# Altium schematic sheet main.SchDoc: Наименование
size 839 x 594 mm; ApprovedBy: Утвердил; CheckedBy: Проверил; Author: Разработал; CompanyName: Организация; DrawnBy: Н.Контр; Engineer: Т.Контр; SheetNumber: 1; SheetTotal: 1; PageSetup: Record=PageOptions|CenterHorizontal=True|CenterVertical=True|PrintScale=0.94|XCorrection=1.00|YCorrection=1.00|PrintKind=1|BorderSize=5000000|LeftOffset=0|BottomOffset=0|Orientation=1|PaperLength=1000|PaperWidth=1000|Scale=100|PaperSource=7|PrintQuality=-4|MediaType=1|DitherType=10|PaperKind=A4|PrintScaleMode=1; DecimalNumber: Децимальный номер; HeadOfSector: Нач. сектора; MainDevice: Перв.примен.; Name: Наименование; DocumentName: Sheet1.SCHDOC
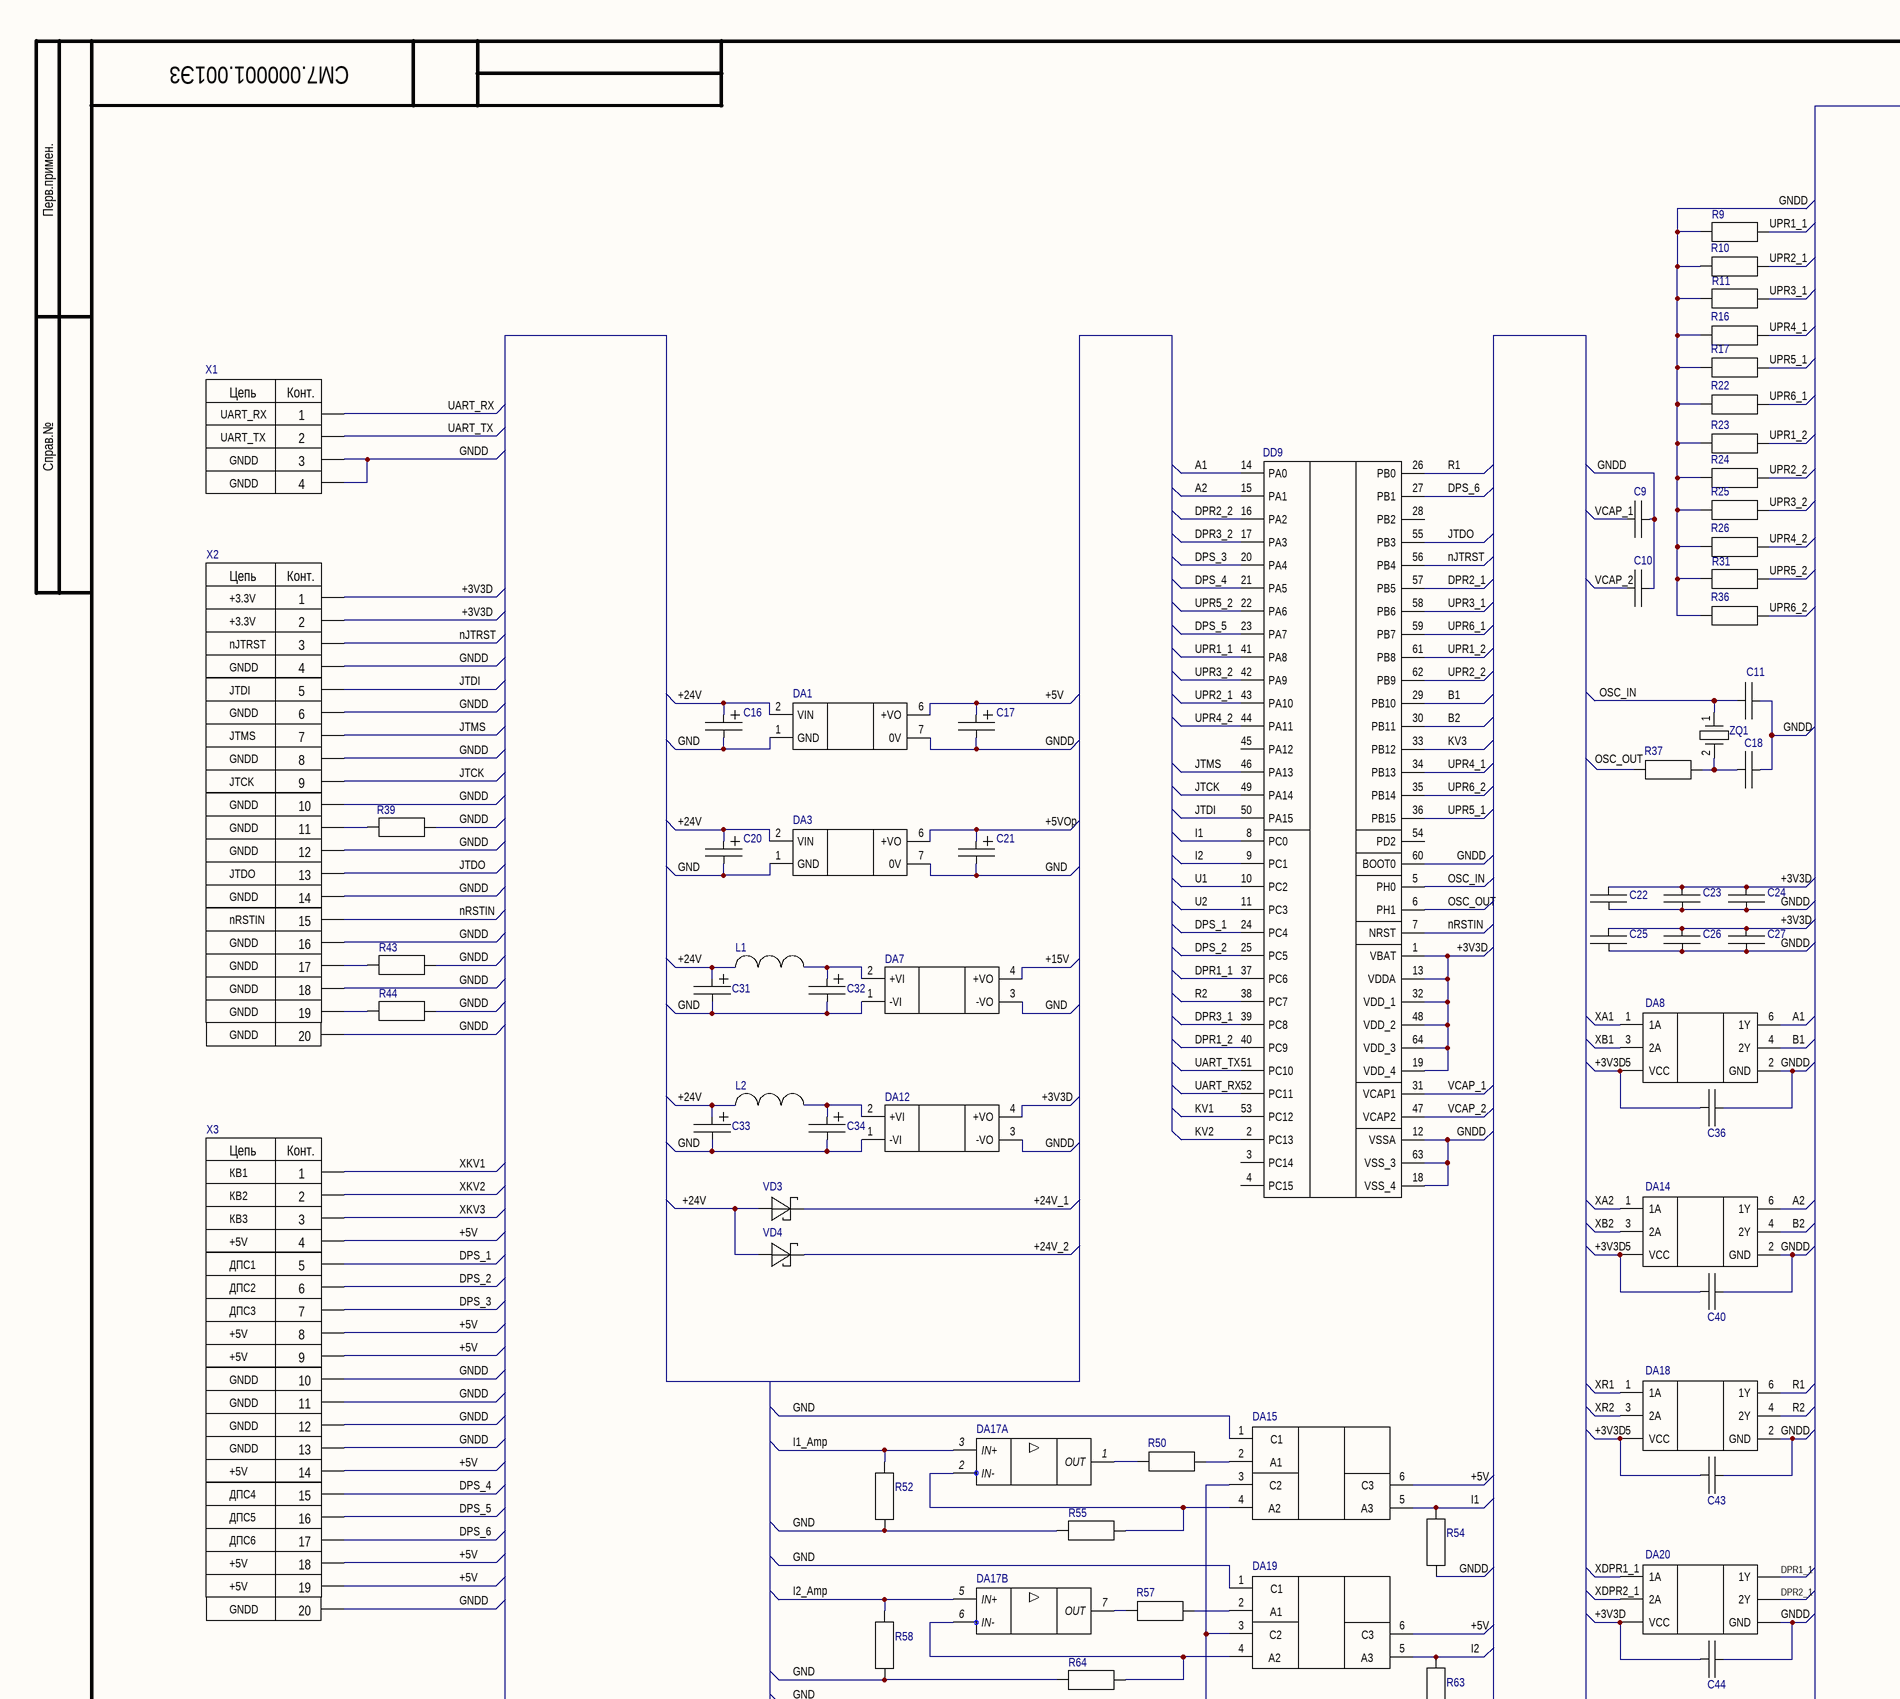
[diagram p0: main.SchDoc, top left]
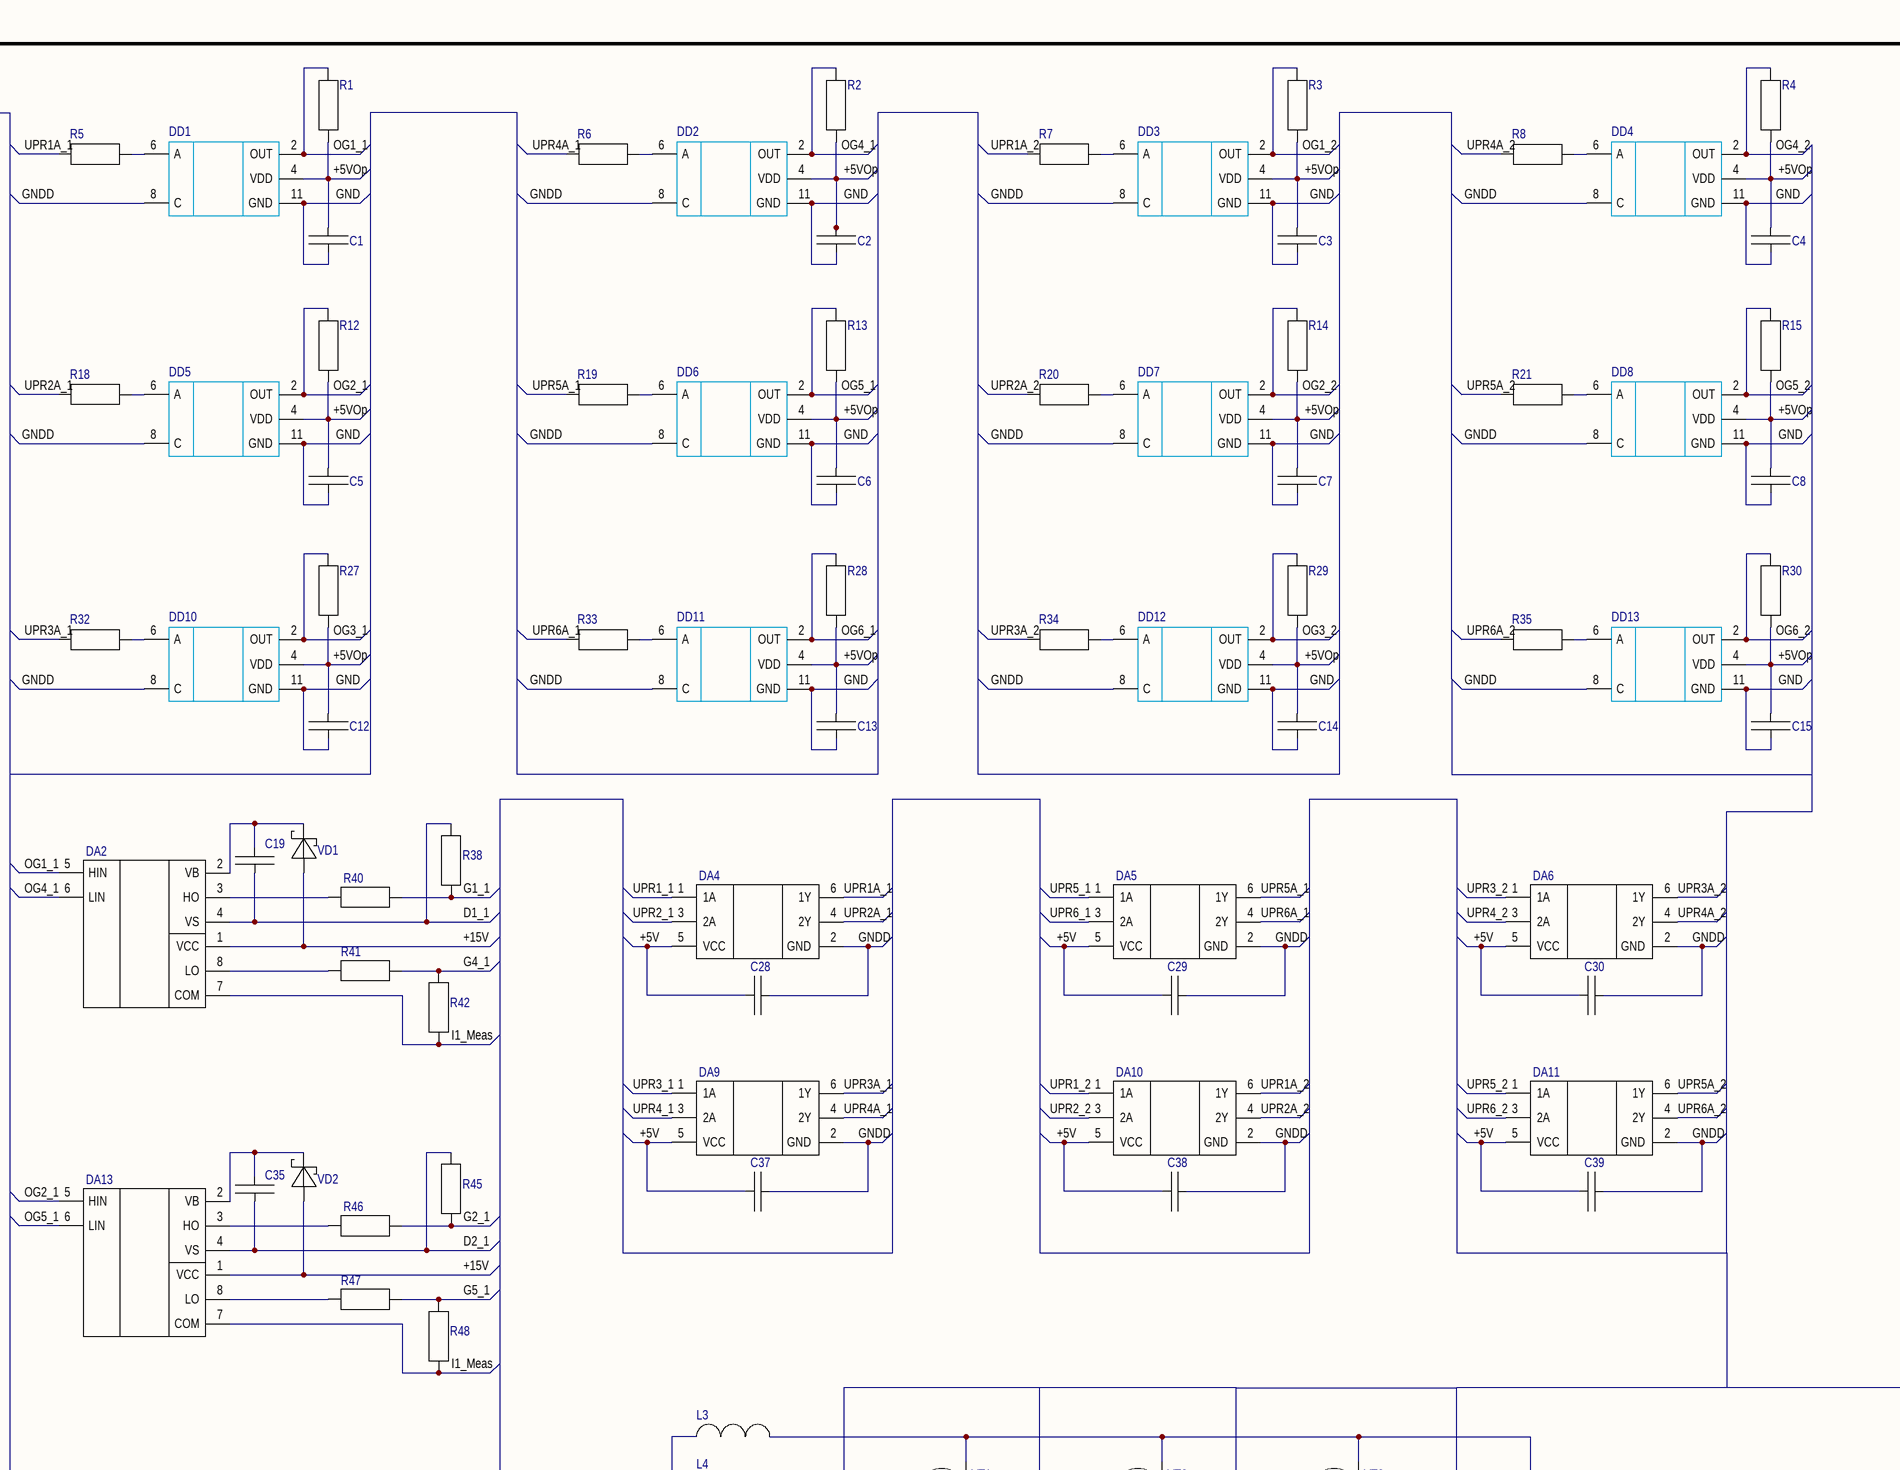
[diagram p1: main.SchDoc, top right]
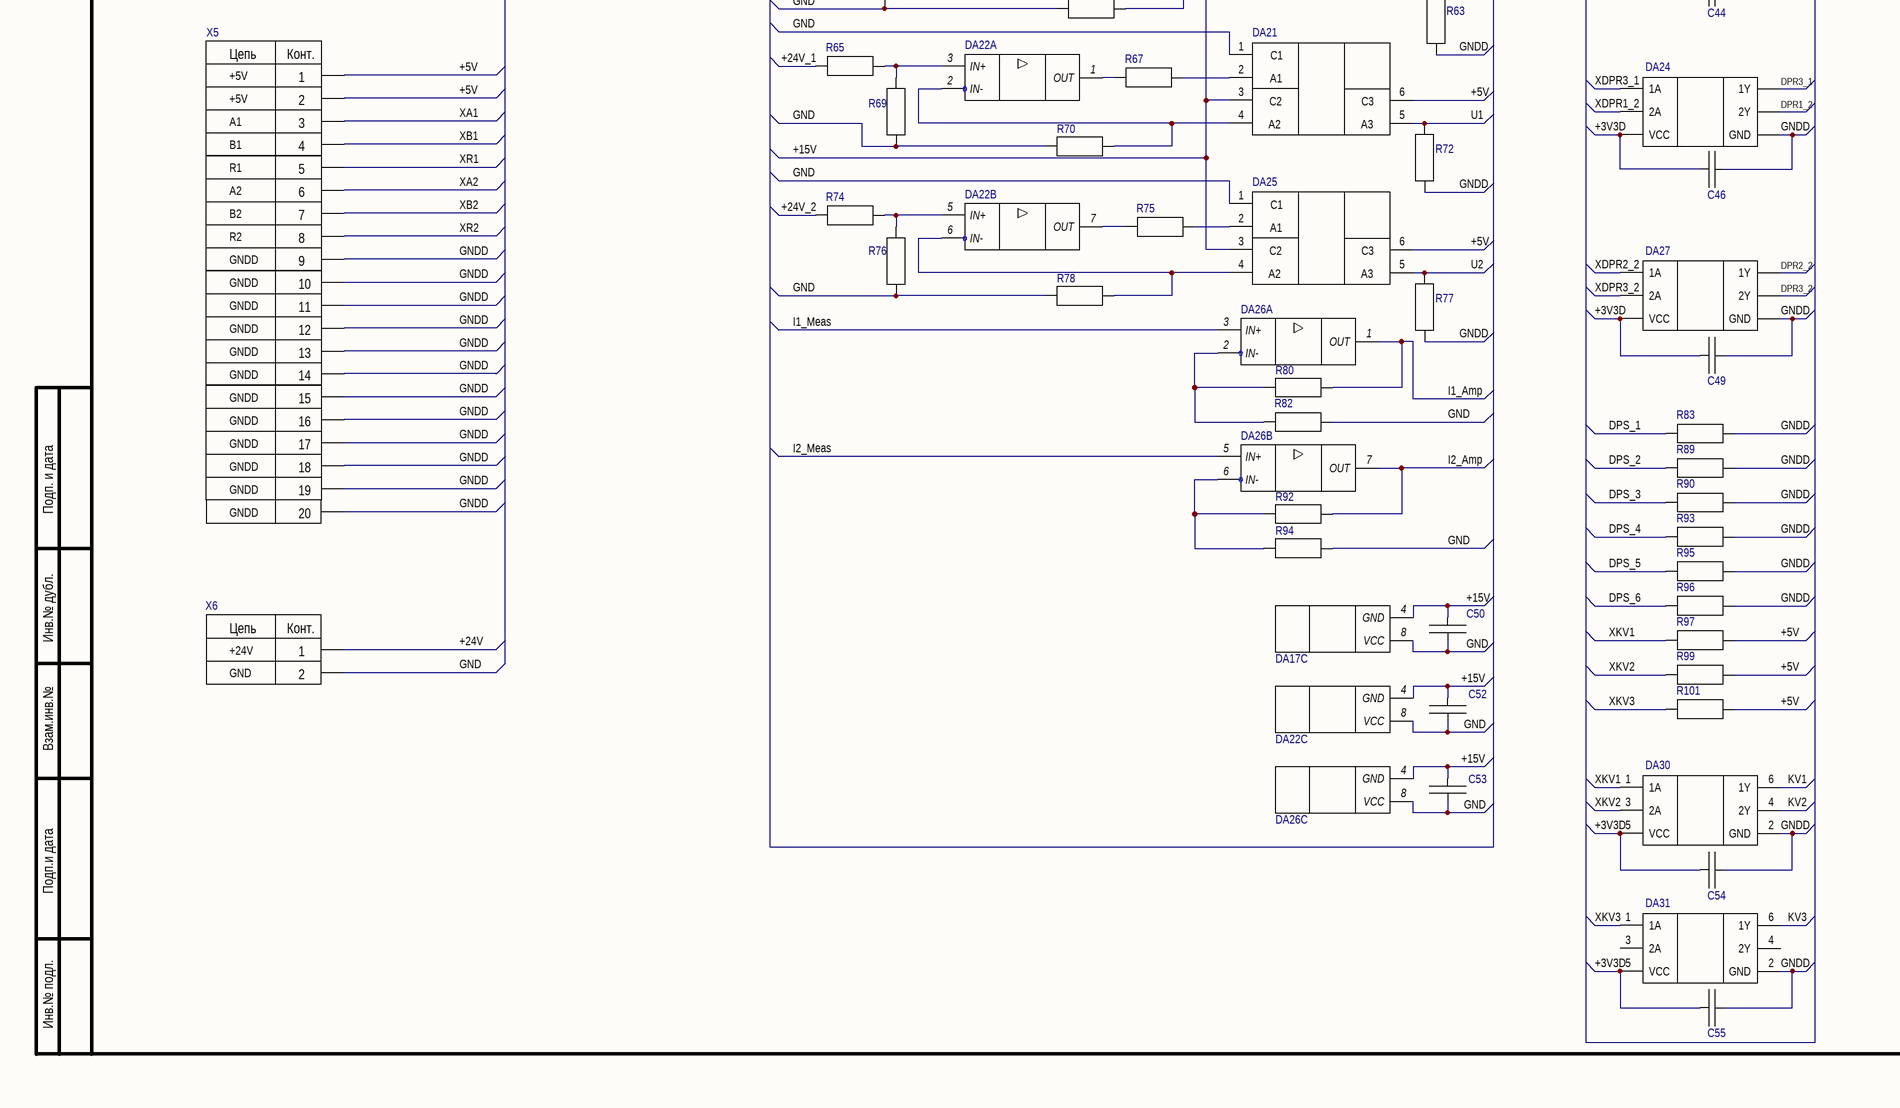
[diagram p2: main.SchDoc, bottom left]
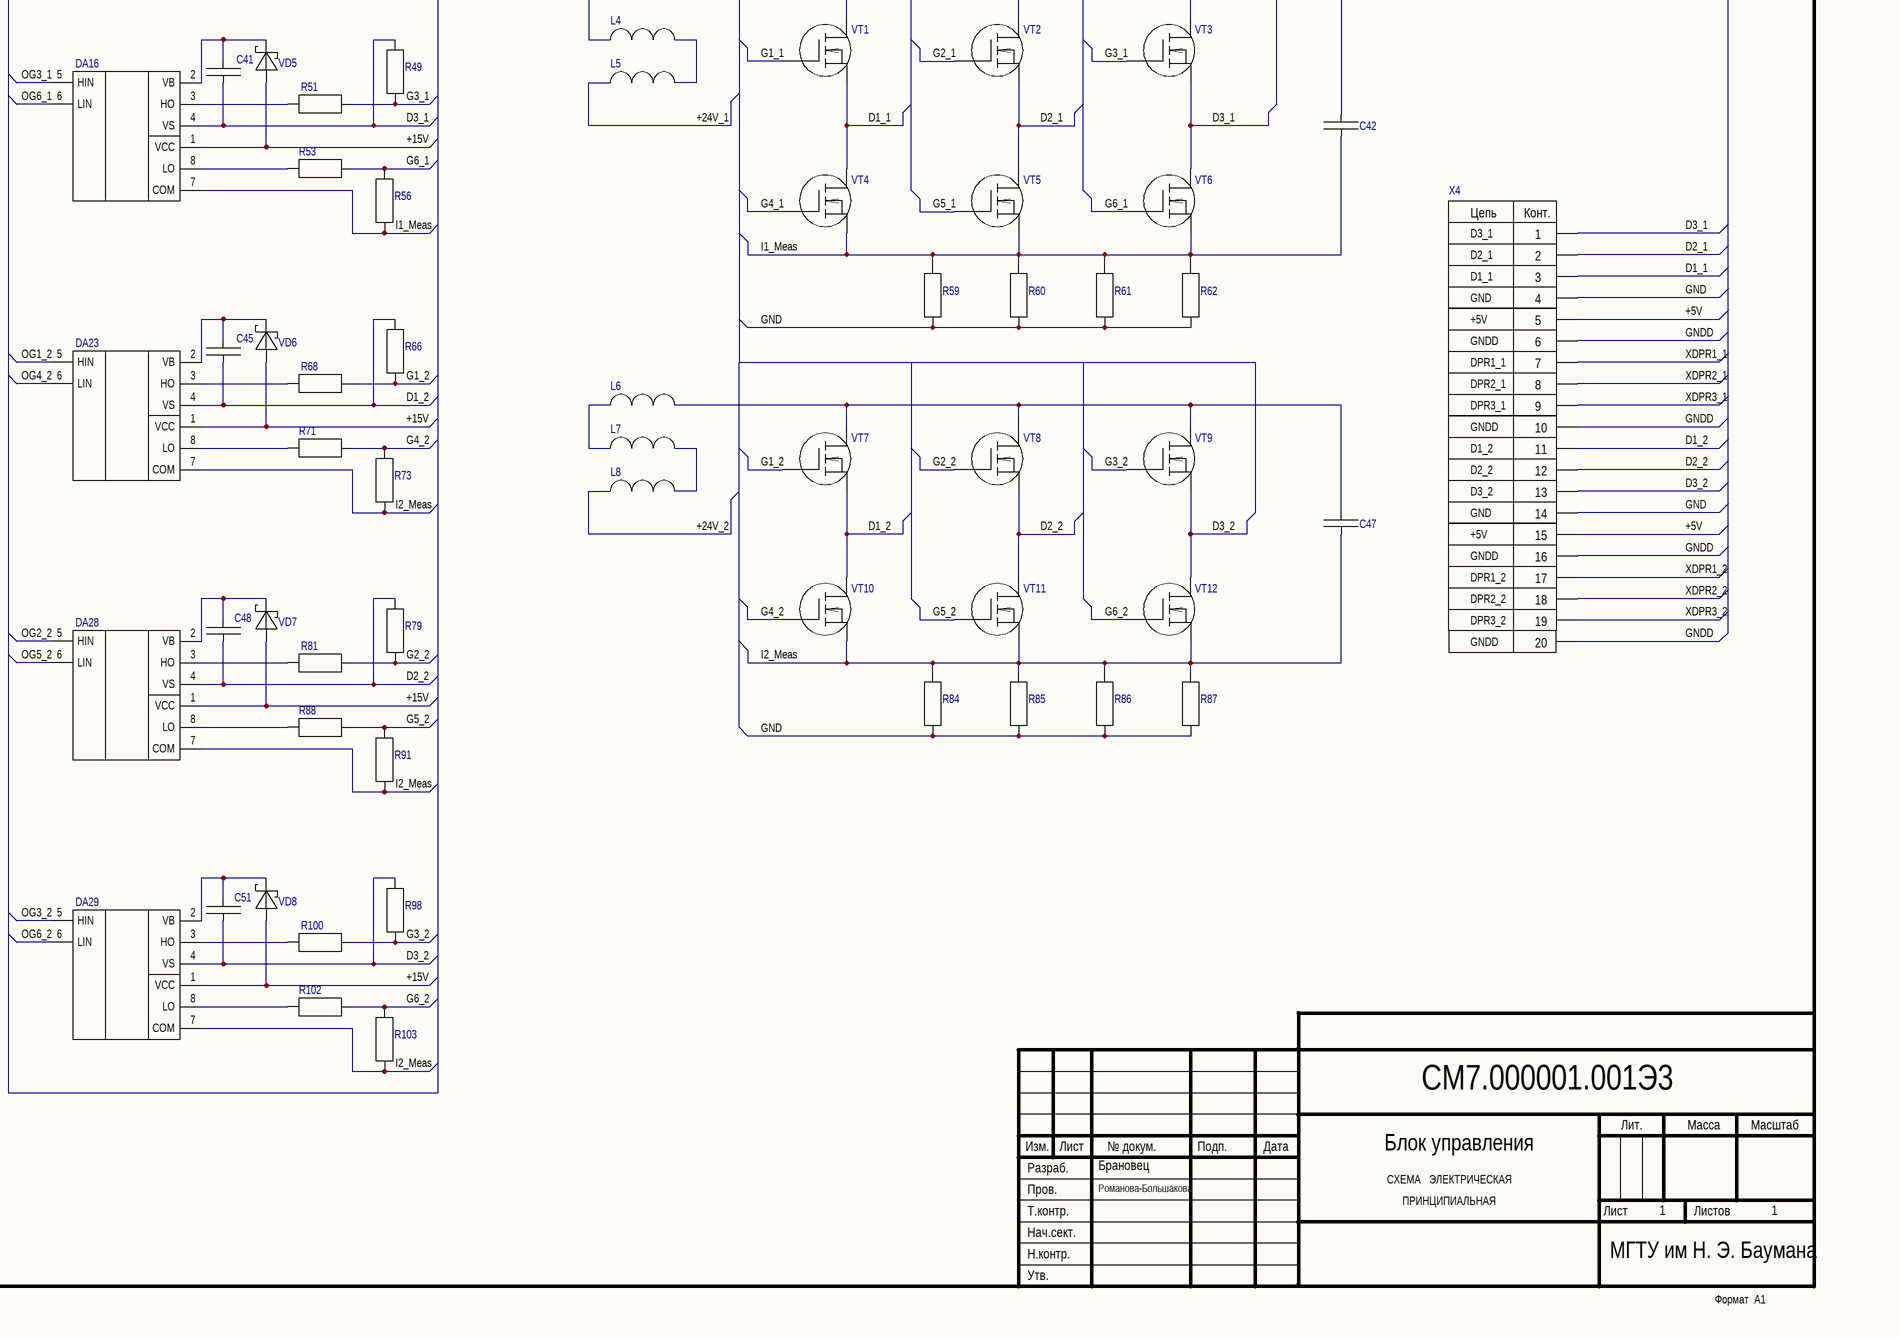
[diagram p3: main.SchDoc, bottom right]

## Parts
C1  0,1uF  [C0402C]  (value not drawn)
C2  0,1uF  [C0402C]  (value not drawn)
C3  0,1uF  [C0402C]  (value not drawn)
C4  0,1uF  [C0402C]  (value not drawn)
C5  0,1uF  [C0402C]  (value not drawn)
C6  0,1uF  [C0402C]  (value not drawn)
C7  0,1uF  [C0402C]  (value not drawn)
C8  0,1uF  [C0402C]  (value not drawn)
C9  2,2uF  [C0805C]  (value not drawn)
C10  2,2uF  [C0805C]  (value not drawn)
C11  15pF  [C0603C]  (value not drawn)
C12  0,1uF  [C0402C]  (value not drawn)
C13  0,1uF  [C0402C]  (value not drawn)
C14  0,1uF  [C0402C]  (value not drawn)
C15  0,1uF  [C0402C]  (value not drawn)
C16  100,0uF 50V  [CAPAE-F]  (value not drawn)
C17  22,0uF 25V  [CAPAE-C]  (value not drawn)
C18  15pF  [C0603C]  (value not drawn)
C19  0,1uF  [C0603C]  (value not drawn)
C20  100,0uF 50V  [CAPAE-F]  (value not drawn)
C21  22,0uF 25V  [CAPAE-C]  (value not drawn)
C22  0,1uF  [C0402C]  (value not drawn)
C23  0,1uF  [C0402C]  (value not drawn)
C24  0,1uF  [C0402C]  (value not drawn)
C25  0,1uF  [C0402C]  (value not drawn)
C26  0,1uF  [C0402C]  (value not drawn)
C27  0,1uF  [C0402C]  (value not drawn)
C28  0,1uF  [C0603C]  (value not drawn)
C29  0,1uF  [C0603C]  (value not drawn)
C30  0,1uF  [C0603C]  (value not drawn)
C31  22,0uF 80V  [CAPAE-F]  (value not drawn)
C32  22,0uF 80V  [CAPAE-F]  (value not drawn)
C33  22,0uF 80V  [CAPAE-F]  (value not drawn)
C34  22,0uF 80V  [CAPAE-F]  (value not drawn)
C35  0,1uF  [C0603C]  (value not drawn)
C36  0,1uF  [C0402C]  (value not drawn)
C37  0,1uF  [C0603C]  (value not drawn)
C38  0,1uF  [C0603C]  (value not drawn)
C39  0,1uF  [C0603C]  (value not drawn)
C40  0,1uF  [C0402C]  (value not drawn)
C41  0,1uF  [C0603C]  (value not drawn)
C42  2,2uF  [C1210C]  (value not drawn)
C43  0,1uF  [C0402C]  (value not drawn)
C44  0,1uF  [C0402C]  (value not drawn)
C45  0,1uF  [C0603C]  (value not drawn)
C46  0,1uF  [C0402C]  (value not drawn)
C47  2,2uF  [C1210C]  (value not drawn)
C48  0,1uF  [C0603C]  (value not drawn)
C49  0,1uF  [C0402C]  (value not drawn)
C50  0,1uF  [C0603C]  (value not drawn)
C51  0,1uF  [C0603C]  (value not drawn)
C52  0,1uF  [C0603C]  (value not drawn)
C53  0,1uF  [C0603C]  (value not drawn)
C54  0,1uF  [C0402C]  (value not drawn)
C55  0,1uF  [C0402C]  (value not drawn)
DA1  UWF1205S-3WR3  [UWES-3WR3]  (value not drawn)
DA2  IRS2011SPbf  [SO-8]  (value not drawn)
DA3  UWF1205S-3WR3  [UWES-3WR3]  (value not drawn)
DA4  SN74LVC2G17  [SOT23-6]  (value not drawn)
DA5  SN74LVC2G17  [SOT23-6]  (value not drawn)
DA6  SN74LVC2G17  [SOT23-6]  (value not drawn)
DA7  AM2S-2415SZ  [AM2S-Z]  (value not drawn)
DA8  SN74LVC2G17  [SOT23-6]  (value not drawn)
DA9  SN74LVC2G17  [SOT23-6]  (value not drawn)
DA10  SN74LVC2G17  [SOT23-6]  (value not drawn)
DA11  SN74LVC2G17  [SOT23-6]  (value not drawn)
DA12  AM2S-2403SZ  [AM2S-Z]  (value not drawn)
DA13  IRS2011SPbf  [SO-8]  (value not drawn)
DA14  SN74LVC2G17  [SOT23-6]  (value not drawn)
DA15  IL300  [DIP8]  (value not drawn)
DA16  IRS2011SPbf  [SO-8]  (value not drawn)
DA17  LM2904DR2G  [SO-8]  (value not drawn)  (parts A,B,C of 3)
DA18  SN74LVC2G17  [SOT23-6]  (value not drawn)
DA19  IL300  [DIP8]  (value not drawn)
DA20  SN74LVC2G17  [SOT23-6]  (value not drawn)
DA21  IL300  [DIP8]  (value not drawn)
DA22  LM2904DR2G  [SO-8]  (value not drawn)  (parts A,B,C of 3)
DA23  IRS2011SPbf  [SO-8]  (value not drawn)
DA24  SN74LVC2G17  [SOT23-6]  (value not drawn)
DA25  IL300  [DIP8]  (value not drawn)
DA26  LM2904DR2G  [SO-8]  (value not drawn)  (parts A,B,C of 3)
DA27  SN74LVC2G17  [SOT23-6]  (value not drawn)
DA28  IRS2011SPbf  [SO-8]  (value not drawn)
DA29  IRS2011SPbf  [SO-8]  (value not drawn)
DA30  SN74LVC2G17  [SOT23-6]  (value not drawn)
DA31  SN74LVC2G17  [SOT23-6]  (value not drawn)
DD1  249ЛП5  [401.14-3]  (value not drawn)
DD2  249ЛП5  [401.14-3]  (value not drawn)
DD3  249ЛП5  [401.14-3]  (value not drawn)
DD4  249ЛП5  [401.14-3]  (value not drawn)
DD5  249ЛП5  [401.14-3]  (value not drawn)
DD6  249ЛП5  [401.14-3]  (value not drawn)
DD7  249ЛП5  [401.14-3]  (value not drawn)
DD8  249ЛП5  [401.14-3]  (value not drawn)
DD9  STM32F205RGT6  [LQFP64]  (value not drawn)
DD10  249ЛП5  [401.14-3]  (value not drawn)
DD11  249ЛП5  [401.14-3]  (value not drawn)
DD12  249ЛП5  [401.14-3]  (value not drawn)
DD13  249ЛП5  [401.14-3]  (value not drawn)
L1  IHLP6767GZER150M01  [IHLP-6767GZ-01]  (value not drawn)
L2  IHLP6767GZER150M01  [IHLP-6767GZ-01]  (value not drawn)
L3  IHLP6767GZER101  [IHLP-6767GZ-11]  (value not drawn)
L4  IHLP6767GZER101  [IHLP-6767GZ-11]  (value not drawn)
L5  IHLP6767GZER101  [IHLP-6767GZ-11]  (value not drawn)
L6  IHLP6767GZER101  [IHLP-6767GZ-11]  (value not drawn)
L7  IHLP6767GZER101  [IHLP-6767GZ-11]  (value not drawn)
L8  IHLP6767GZER101  [IHLP-6767GZ-11]  (value not drawn)
R1  340R  [C0805R]  (value not drawn)
R2  340R  [C0805R]  (value not drawn)
R3  340R  [C0805R]  (value not drawn)
R4  340R  [C0805R]  (value not drawn)
R5  169R  [C0805R]  (value not drawn)
R6  169R  [C0805R]  (value not drawn)
R7  169R  [C0805R]  (value not drawn)
R8  169R  [C0805R]  (value not drawn)
R9  20k  [C0402R]  (value not drawn)
R10  20k  [C0402R]  (value not drawn)
R11  20k  [C0402R]  (value not drawn)
R12  340R  [C0805R]  (value not drawn)
R13  340R  [C0805R]  (value not drawn)
R14  340R  [C0805R]  (value not drawn)
R15  340R  [C0805R]  (value not drawn)
R16  20k  [C0402R]  (value not drawn)
R17  20k  [C0402R]  (value not drawn)
R18  169R  [C0805R]  (value not drawn)
R19  169R  [C0805R]  (value not drawn)
R20  169R  [C0805R]  (value not drawn)
R21  169R  [C0805R]  (value not drawn)
R22  20k  [C0402R]  (value not drawn)
R23  20k  [C0402R]  (value not drawn)
R24  20k  [C0402R]  (value not drawn)
R25  20k  [C0402R]  (value not drawn)
R26  20k  [C0402R]  (value not drawn)
R27  340R  [C0805R]  (value not drawn)
R28  340R  [C0805R]  (value not drawn)
R29  340R  [C0805R]  (value not drawn)
R30  340R  [C0805R]  (value not drawn)
R31  20k  [C0402R]  (value not drawn)
R32  169R  [C0805R]  (value not drawn)
R33  169R  [C0805R]  (value not drawn)
R34  169R  [C0805R]  (value not drawn)
R35  169R  [C0805R]  (value not drawn)
R36  20k  [C0402R]  (value not drawn)
R37  680R  [C0402R]  (value not drawn)
R38  10k  [C0805R]  (value not drawn)
R39  10k  [C0402R]  (value not drawn)
R40  15R  [C0805R]  (value not drawn)
R41  15R  [C0805R]  (value not drawn)
R42  10k  [C0805R]  (value not drawn)
R43  10k  [C0402R]  (value not drawn)
R44  10k  [C0402R]  (value not drawn)
R45  10k  [C0805R]  (value not drawn)
R46  15R  [C0805R]  (value not drawn)
R47  15R  [C0805R]  (value not drawn)
R48  10k  [C0805R]  (value not drawn)
R49  10k  [C0805R]  (value not drawn)
R50  1.2k  [C0402R]  (value not drawn)
R51  15R  [C0805R]  (value not drawn)
R52  20k  [C0402R]  (value not drawn)
R53  15R  [C0805R]  (value not drawn)
R54  47k  [C0402R]  (value not drawn)
R55  20k  [C0402R]  (value not drawn)
R56  10k  [C0805R]  (value not drawn)
R57  1.2k  [C0402R]  (value not drawn)
R58  20k  [C0402R]  (value not drawn)
R59  0R20  [WSR-3]  (value not drawn)
R60  0R20  [WSR-3]  (value not drawn)
R61  0R20  [WSR-3]  (value not drawn)
R62  0R20  [WSR-3]  (value not drawn)
R63  47k  [C0402R]  (value not drawn)
R64  20k  [C0402R]  (value not drawn)
R65  620k  [C0402R]  (value not drawn)
R66  10k  [C0805R]  (value not drawn)
R67  1.2k  [C0402R]  (value not drawn)
R68  15R  [C0805R]  (value not drawn)
R69  20k  [C0402R]  (value not drawn)
R70  20k  [C0402R]  (value not drawn)
R71  15R  [C0805R]  (value not drawn)
R72  47k  [C0402R]  (value not drawn)
R73  10k  [C0805R]  (value not drawn)
R74  620k  [C0402R]  (value not drawn)
R75  1.2k  [C0402R]  (value not drawn)
R76  20k  [C0402R]  (value not drawn)
R77  47k  [C0402R]  (value not drawn)
R78  20k  [C0402R]  (value not drawn)
R79  10k  [C0805R]  (value not drawn)
R80  18k  [C0402R]  (value not drawn)
R81  15R  [C0805R]  (value not drawn)
R82  10k  [C0402R]  (value not drawn)
R83  95,3R  [C0805R]  (value not drawn)
R84  0R20  [WSR-3]  (value not drawn)
R85  0R20  [WSR-3]  (value not drawn)
R86  0R20  [WSR-3]  (value not drawn)
R87  0R20  [WSR-3]  (value not drawn)
R88  15R  [C0805R]  (value not drawn)
R89  95,3R  [C0805R]  (value not drawn)
R90  95,3R  [C0805R]  (value not drawn)
R91  10k  [C0805R]  (value not drawn)
R92  18k  [C0402R]  (value not drawn)
R93  95,3R  [C0805R]  (value not drawn)
R94  10k  [C0402R]  (value not drawn)
R95  95,3R  [C0805R]  (value not drawn)
R96  95,3R  [C0805R]  (value not drawn)
R97  1k  [C0402R]  (value not drawn)
R98  10k  [C0805R]  (value not drawn)
R99  1k  [C0402R]  (value not drawn)
R100  15R  [C0805R]  (value not drawn)
R101  1k  [C0402R]  (value not drawn)
R102  15R  [C0805R]  (value not drawn)
R103  10k  [C0805R]  (value not drawn)
VD1  DFLS160-7  [SOD123]  (value not drawn)
VD2  DFLS160-7  [SOD123]  (value not drawn)
VD3  VS-8TQ100S-M3  [D2-PAK]  (value not drawn)
VD4  VS-8TQ100S-M3  [D2-PAK]  (value not drawn)
VD5  DFLS160-7  [SOD123]  (value not drawn)
VD6  DFLS160-7  [SOD123]  (value not drawn)
VD7  DFLS160-7  [SOD123]  (value not drawn)
VD8  DFLS160-7  [SOD123]  (value not drawn)
VT1  IRFR7740PbF  [D-PAK]  (value not drawn)
VT2  IRFR7740PbF  [D-PAK]  (value not drawn)
VT3  IRFR7740PbF  [D-PAK]  (value not drawn)
VT4  IRFR7740PbF  [D-PAK]  (value not drawn)
VT5  IRFR7740PbF  [D-PAK]  (value not drawn)
VT6  IRFR7740PbF  [D-PAK]  (value not drawn)
VT7  IRFR7740PbF  [D-PAK]  (value not drawn)
VT8  IRFR7740PbF  [D-PAK]  (value not drawn)
VT9  IRFR7740PbF  [D-PAK]  (value not drawn)
VT10  IRFR7740PbF  [D-PAK]  (value not drawn)
VT11  IRFR7740PbF  [D-PAK]  (value not drawn)
VT12  IRFR7740PbF  [D-PAK]  (value not drawn)
X1  22-27-2041  [22-27-2041]  (value not drawn)
X2  430452009  [MolexMicroFit 10x2]  (value not drawn)
X3  430452009  [MolexMicroFit 10x2]  (value not drawn)
X4  430452009  [MolexMicroFit 10x2]  (value not drawn)
X5  430452009  [MolexMicroFit 10x2]  (value not drawn)
X6  XT30U-F  [HEADER 2 XT30U]  (value not drawn)
ZQ1  8 МГц  [ABM3]  (value not drawn)

## Nets
+3V3D: C22.1 C23.1 C24.1 C25.1 C26.1 C27.1 C36.1 C40.1 C43.1 C44.1 C46.1 C49.1 C54.1 C55.1 DA8.5(VCC) DA12.4(+VO) DA14.5(VCC) DA18.5(VCC) DA20.5(VCC) DA24.5(VCC) DA27.5(VCC) DA30.5(VCC) DA31.5(VCC) DD9.1(VBAT) DD9.13(VDDA) DD9.19(VDD_4) DD9.32(VDD_1) DD9.48(VDD_2) DD9.64(VDD_3) X2.1 X2.2
+5V: C17.1 C28.2 C29.2 C30.2 C37.2 C38.2 C39.2 DA1.6(+VO) DA4.5(VCC) DA5.5(VCC) DA6.5(VCC) DA9.5(VCC) DA10.5(VCC) DA11.5(VCC) DA15.6 DA19.6 DA21.6 DA25.6 R97.1 R99.1 R101.1 X3.4 X3.8 X3.9 X3.14 X3.18 X3.19 X4.5 X4.15 X5.1 X5.2
+5VOp: C1.1 C2.1 C3.1 C4.1 C5.1 C6.1 C7.1 C8.1 C12.1 C13.1 C14.1 C15.1 C21.1 DA3.6(+VO) DD1.4(VDD) DD2.4(VDD) DD3.4(VDD) DD4.4(VDD) DD5.4(VDD) DD6.4(VDD) DD7.4(VDD) DD8.4(VDD) DD10.4(VDD) DD11.4(VDD) DD12.4(VDD) DD13.4(VDD) R1.2 R2.2 R3.2 R4.2 R12.2 R13.2 R14.2 R15.2 R27.2 R28.2 R29.2 R30.2
+15V: C50.2 C52.2 C53.2 DA2.1(VCC) DA7.4(+VO) DA13.1(VCC) DA15.3 DA16.1(VCC) DA17.4(GND) DA19.3 DA21.3 DA22.4(GND) DA23.1(VCC) DA25.3 DA26.4(GND) DA28.1(VCC) DA29.1(VCC) VD1.A VD2.A VD5.A VD6.A VD7.A VD8.A
+24V: C16.1 C20.1 C31.1 C33.1 DA1.2(VIN) DA3.2(VIN) L1.1 L2.1 VD3.A VD4.A X6.1
+24V_1: L5.1 R65.2 VD3.C
+24V_2: L8.1 R74.2 VD4.C
A1: DA8.6(1Y) DD9.14(PA0)
A2: DA14.6(1Y) DD9.15(PA1)
B1: DA8.4(2Y) DD9.29(PB10)
B2: DA14.4(2Y) DD9.30(PB11)
D1_1: C19.2 DA2.4(VS) R38.1 VT1.S VT4.D X4.3
D1_2: C45.2 DA23.4(VS) R66.1 VT7.S VT10.D X4.11
D2_1: C35.2 DA13.4(VS) R45.1 VT2.S VT5.D X4.2
D2_2: C48.2 DA28.4(VS) R79.1 VT8.S VT11.D X4.12
D3_1: C41.2 DA16.4(VS) R49.1 VT3.S VT6.D X4.1
D3_2: C51.2 DA29.4(VS) R98.1 VT9.S VT12.D X4.13
DPR1_1: DA20.6(1Y) DD9.37(PC6)
DPR1_2: DA24.4(2Y) DD9.40(PC9)
DPR2_1: DA20.4(2Y) DD9.57(PB5)
DPR2_2: DA27.6(1Y) DD9.16(PA2)
DPR3_1: DA24.6(1Y) DD9.39(PC8)
DPR3_2: DA27.4(2Y) DD9.17(PA3)
DPS_1: DD9.24(PC4) R83.2 X3.5
DPS_2: DD9.25(PC5) R89.2 X3.6
DPS_3: DD9.20(PA4) R90.2 X3.7
DPS_4: DD9.21(PA5) R93.2 X3.15
DPS_5: DD9.23(PA7) R95.2 X3.16
DPS_6: DD9.27(PB1) R96.2 X3.17
G1_1: R38.2 R40.1 VT1.G
G1_2: R66.2 R68.1 VT7.G
G2_1: R45.2 R46.1 VT2.G
G2_2: R79.2 R81.1 VT8.G
G3_1: R49.2 R51.1 VT3.G
G3_2: R98.2 R100.1 VT9.G
G4_1: R41.1 R42.1 VT4.G
G4_2: R71.1 R73.1 VT10.G
G5_1: R47.1 R48.1 VT5.G
G5_2: R88.1 R91.1 VT11.G
G6_1: R53.1 R56.1 VT6.G
G6_2: R102.1 R103.1 VT12.G
GND: C1.2 C2.2 C3.2 C4.2 C5.2 C6.2 C7.2 C8.2 C12.2 C13.2 C14.2 C15.2 C16.2 C20.2 C21.2 C31.2 C32.2 C33.2 C34.2 C50.1 C52.1 C53.1 DA1.1(GND) DA3.1(GND) DA3.7(0V) DA7.1(-VI) DA7.3(-VO) DA12.1(-VI) DA15.1 DA17.8(VCC) DA19.1 DA21.1 DA22.8(VCC) DA25.1 DA26.8(VCC) DD1.11(GND) DD2.11(GND) DD3.11(GND) DD4.11(GND) DD5.11(GND) DD6.11(GND) DD7.11(GND) DD8.11(GND) DD10.11(GND) DD11.11(GND) DD12.11(GND) DD13.11(GND) R52.2 R55.1 R58.2 R59.2 R60.2 R61.2 R62.2 R64.1 R69.2 R70.1 R76.2 R78.1 R82.1 R84.2 R85.2 R86.2 R87.2 R94.1 X4.4 X4.14 X6.2
GNDD: C9.2 C10.2 C11.2 C17.2 C18.2 C22.2 C23.2 C24.2 C25.2 C26.2 C27.2 C28.1 C29.1 C30.1 C36.2 C37.1 C38.1 C39.1 C40.2 C43.2 C44.2 C46.2 C49.2 C54.2 C55.2 DA1.7(0V) DA4.2(GND) DA5.2(GND) DA6.2(GND) DA8.2(GND) DA9.2(GND) DA10.2(GND) DA11.2(GND) DA12.3(-VO) DA14.2(GND) DA18.2(GND) DA20.2(GND) DA24.2(GND) DA27.2(GND) DA30.2(GND) DA31.2(GND) DD1.8(C) DD2.8(C) DD3.8(C) DD4.8(C) DD5.8(C) DD6.8(C) DD7.8(C) DD8.8(C) DD9.12(VSSA) DD9.18(VSS_4) DD9.60(BOOT0) DD9.63(VSS_3) DD10.8(C) DD11.8(C) DD12.8(C) DD13.8(C) R9.2 R10.2 R11.2 R16.2 R17.2 R22.2 R23.2 R24.2 R25.2 R26.2 R31.2 R36.2 R39.1 R43.1 R44.1 R54.2 R63.2 R72.2 R77.2 R83.1 R89.1 R90.1 R93.1 R95.1 R96.1 X1.3 X1.4 X2.4 X2.6 X2.8 X2.10 X2.12 X2.14 X2.16 X2.18 X2.20 X3.10 X3.11 X3.12 X3.13 X3.20 X4.6 X4.10 X4.16 X4.20 X5.9 X5.10 X5.11 X5.12 X5.13 X5.14 X5.15 X5.16 X5.17 X5.18 X5.19 X5.20
I1: DA15.5 DD9.8(PC0) R54.1
I1_Amp: DA17.3(IN+) DA26.1(OUT) R52.1 R80.1
I1_Meas: C42.2 DA2.7(COM) DA13.7(COM) DA16.7(COM) DA26.3(IN+) R42.2 R48.2 R56.2 R59.1 R60.1 R61.1 R62.1 VT4.S VT5.S VT6.S
I2: DA19.5 DD9.9(PC1) R63.1
I2_Amp: DA17.5(IN+) DA26.7(OUT) R58.1 R92.1
I2_Meas: C47.2 DA23.7(COM) DA26.5(IN+) DA28.7(COM) DA29.7(COM) R73.2 R84.1 R85.1 R86.1 R87.1 R91.2 R103.2 VT10.S VT11.S VT12.S
JTCK: DD9.49(PA14) X2.9
JTDI: DD9.50(PA15) X2.5
JTDO: DD9.55(PB3) X2.13
JTMS: DD9.46(PA13) X2.7
KV1: DA30.6(1Y) DD9.53(PC12)
KV2: DA30.4(2Y) DD9.2(PC13)
KV3: DA31.6(1Y) DD9.33(PB12)
nJTRST: DD9.56(PB4) X2.3
nRSTIN: DD9.7(NRST) X2.15
OG1_1: DA2.5(HIN) DD1.2(OUT) R1.1
OG1_2: DA23.5(HIN) DD3.2(OUT) R3.1
OG2_1: DA13.5(HIN) DD5.2(OUT) R12.1
OG2_2: DA28.5(HIN) DD7.2(OUT) R14.1
OG3_1: DA16.5(HIN) DD10.2(OUT) R27.1
OG3_2: DA29.5(HIN) DD12.2(OUT) R29.1
OG4_1: DA2.6(LIN) DD2.2(OUT) R2.1
OG4_2: DA23.6(LIN) DD4.2(OUT) R4.1
OG5_1: DA13.6(LIN) DD6.2(OUT) R13.1
OG5_2: DA28.6(LIN) DD8.2(OUT) R15.1
OG6_1: DA16.6(LIN) DD11.2(OUT) R28.1
OG6_2: DA29.6(LIN) DD13.2(OUT) R30.1
OSC_IN: C11.1 DD9.5(PH0) ZQ1.1(OSC1)
OSC_OUT: DD9.6(PH1) R37.2
R1: DA18.6(1Y) DD9.26(PB0)
R2: DA18.4(2Y) DD9.38(PC7)
U1: DA21.5 DD9.10(PC2) R72.1
U2: DA25.5 DD9.11(PC3) R77.1
UART_RX: DD9.52(PC11) X1.1
UART_TX: DD9.51(PC10) X1.2
UPR1_1: DA4.1(1A) DD9.41(PA8) R9.1
UPR1_2: DA10.1(1A) DD9.61(PB8) R23.1
UPR1A_1: DA4.6(1Y) R5.2
UPR1A_2: DA10.6(1Y) R7.2
UPR2_1: DA4.3(2A) DD9.43(PA10) R10.1
UPR2_2: DA10.3(2A) DD9.62(PB9) R24.1
UPR2A_1: DA4.4(2Y) R18.2
UPR2A_2: DA10.4(2Y) R20.2
UPR3_1: DA9.1(1A) DD9.58(PB6) R11.1
UPR3_2: DA6.1(1A) DD9.42(PA9) R25.1
UPR3A_1: DA9.6(1Y) R32.2
UPR3A_2: DA6.6(1Y) R34.2
UPR4_1: DA9.3(2A) DD9.34(PB13) R16.1
UPR4_2: DA6.3(2A) DD9.44(PA11) R26.1
UPR4A_1: DA9.4(2Y) R6.2
UPR4A_2: DA6.4(2Y) R8.2
UPR5_1: DA5.1(1A) DD9.36(PB15) R17.1
UPR5_2: DA11.1(1A) DD9.22(PA6) R31.1
UPR5A_1: DA5.6(1Y) R19.2
UPR5A_2: DA11.6(1Y) R21.2
UPR6_1: DA5.3(2A) DD9.59(PB7) R22.1
UPR6_2: DA11.3(2A) DD9.35(PB14) R36.1
UPR6A_1: DA5.4(2Y) R33.2
UPR6A_2: DA11.4(2Y) R35.2
VCAP_1: C9.1 DD9.31(VCAP1)
VCAP_2: C10.1 DD9.47(VCAP2)
XA1: DA8.1(1A) X5.3
XA2: DA14.1(1A) X5.6
XB1: DA8.3(2A) X5.4
XB2: DA14.3(2A) X5.7
XDPR1_1: DA20.1(1A) X4.7
XDPR1_2: DA24.3(2A) X4.17
XDPR2_1: DA20.3(2A) X4.8
XDPR2_2: DA27.1(1A) X4.18
XDPR3_1: DA24.1(1A) X4.9
XDPR3_2: DA27.3(2A) X4.19
XKV1: DA30.1(1A) R97.2 X3.1
XKV2: DA30.3(2A) R99.2 X3.2
XKV3: DA31.1(1A) R101.2 X3.3
XR1: DA18.1(1A) X5.5
XR2: DA18.3(2A) X5.8
NetC18_1: C18.1 R37.1 ZQ1.2(OSC2)
NetC19_1: C19.1 DA2.2(VB) VD1.C
NetC32_1: C32.1 DA7.2(+VI) L1.2
NetC34_1: C34.1 DA12.2(+VI) L2.2
NetC35_1: C35.1 DA13.2(VB) VD2.C
NetC41_1: C41.1 DA16.2(VB) VD5.C
NetC42_1: C42.1 L3.2 VT1.D VT2.D VT3.D
NetC45_1: C45.1 DA23.2(VB) VD6.C
NetC47_1: C47.1 L6.2 VT7.D VT8.D VT9.D
NetC48_1: C48.1 DA28.2(VB) VD7.C
NetC51_1: C51.1 DA29.2(VB) VD8.C
NetDA2_3: DA2.3(HO) R40.2
NetDA2_8: DA2.8(LO) R41.2
NetDA13_3: DA13.3(HO) R46.2
NetDA13_8: DA13.8(LO) R47.2
NetDA15_2: DA15.2 R50.1
NetDA15_4: DA15.4 DA17.2(IN-) R55.2
NetDA16_3: DA16.3(HO) R51.2
NetDA16_8: DA16.8(LO) R53.2
NetDA17_1: DA17.1(OUT) R50.2
NetDA17_6: DA17.6(IN-) DA19.4 R64.2
NetDA17_7: DA17.7(OUT) R57.2
NetDA19_2: DA19.2 R57.1
NetDA21_2: DA21.2 R67.1
NetDA21_4: DA21.4 DA22.2(IN-) R70.2
NetDA22_1: DA22.1(OUT) R67.2
NetDA22_3: DA22.3(IN+) R65.1 R69.1
NetDA22_5: DA22.5(IN+) R74.1 R76.1
NetDA22_6: DA22.6(IN-) DA25.4 R78.2
NetDA22_7: DA22.7(OUT) R75.2
NetDA23_3: DA23.3(HO) R68.2
NetDA23_8: DA23.8(LO) R71.2
NetDA25_2: DA25.2 R75.1
NetDA26_2: DA26.2(IN-) R80.2 R82.2
NetDA26_6: DA26.6(IN-) R92.2 R94.2
NetDA28_3: DA28.3(HO) R81.2
NetDA28_8: DA28.8(LO) R88.2
NetDA29_3: DA29.3(HO) R100.2
NetDA29_8: DA29.8(LO) R102.2
NetDD1_6: DD1.6(A) R5.1
NetDD2_6: DD2.6(A) R6.1
NetDD3_6: DD3.6(A) R7.1
NetDD4_6: DD4.6(A) R8.1
NetDD5_6: DD5.6(A) R18.1
NetDD6_6: DD6.6(A) R19.1
NetDD7_6: DD7.6(A) R20.1
NetDD8_6: DD8.6(A) R21.1
NetDD10_6: DD10.6(A) R32.1
NetDD11_6: DD11.6(A) R33.1
NetDD12_6: DD12.6(A) R34.1
NetDD13_6: DD13.6(A) R35.1
NetL3_1: L3.1 L4.1
NetL4_2: L4.2 L5.2
NetL6_1: L6.1 L7.1
NetL7_2: L7.2 L8.2
NetR39_2: R39.2 X2.11
NetR43_2: R43.2 X2.17
NetR44_2: R44.2 X2.19

Not connected (* = marked no-connect by the designer): DA31 3(2A) 4(2Y); DD9 3(PC14) 4(PC15) 28(PB2) 45(PA12) 54(PD2)

## Notes on the sheet
- СМ7.000001.001Э3
- Перв.примен.
- UART_RX
- Справ.№
- UART_TX
- GNDD
- +3.3V
- nJTRST
- JTDI
- JTMS
- JTCK
- JTDO
- nRSTIN
- КВ1
- КВ2
- КВ3
- +5V
- ДПС1
- ДПС2
- ДПС3
- ДПС4
- ДПС5
- ДПС6
- D3_1
- D2_1
- D1_1
- GND
- DPR1_1
- DPR2_1
- A1
- B1
- D1_2
- DPR3_1
- R1
- A2
- B2
- D2_2
- D3_2
- R2
- DPR1_2
- DPR2_2
- DPR3_2
- Подп. и дата
- Инв.№ дубл.
- +24V
- Взам.инв.№
- Подп.и дата
- Разраб.
- Изм.
- Лист
- № докум.
- Подп.
- Дата
- Блок управления
- Лит.
- Масса
- Масштаб
- Т.контр.
- Пров.
- Брановец
- Романова-Большакова
- СХЕМА   ЭЛЕКТРИЧЕСКАЯ
- ПРИНЦИПИАЛЬНАЯ
- 1
- Листов
- Инв.№ подл.
- Утв.
- Н.контр.
- Нач.сект.
- МГТУ им Н. Э. Баумана
- Формат  A1
- (in symbol 22-27-2041) Цепь; Конт.
- (in symbol 430452009) Цепь; Конт.
- (in symbol IL300) C1; A1; C2; C3; A2; A3
- (in symbol XT30U-F) Цепь; Конт.

## Library data of the parts
C1-C8 C12-C15 C22-C27 C36 C40 C43 C44 C46 C49 C54 C55 = CC0402JRX7R7BB104: CC0402JRX7R7BB104, 0402 X5R 0,1 uF 16V; Manufacturer: Yageo; Value: 0,1; Tolerance: ±10%; Tmin: -55; Tmax: 125; Component Note: 0402 0,1uF ±10% 16V X5R; Part Number: CC0402JRX7R7BB104; Package: SMD 0402; Units: uF; Dielectric: X5R; Voltage: 16V; ComponentLink1Description: Datasheet; gost BOM: 0402 0,1uF ±10% 16V X5R
C9 C10 = CL21B225KAFNNNE: CL21B225KAFNNNE, 0805 X7R 2,2 uF 25V; Manufacturer: Samsung; Value: 2,2; Tolerance: ±10%; Tmin: -55; Tmax: 125; Component Note: 0805 2,2uF ±10% 25V X7R; Part Number: CL21B225KAFNNNE; Package: SMD 0805; Units: uF; Dielectric: X7R; Voltage: 25V; ComponentLink1Description: Datasheet; ComponentLink1URL: https://media.digikey.com/pdf/Data%20Sheets/Samsung%20PDFs/CL_Series_MLCC_ds.pdf; gost BOM: 0805 2,2uF ±10% 25V X7R
C11 C18 = CC0603JRNPO8BN150: CC0603JRNPO8BN150, 0603 NP0 15 pF 25V; Manufacturer: Yageo; Value: 15; Tolerance: ±5%; Tmin: -55; Tmax: 125; Component Note: 0603 15pF ±5% 25V NP0; Part Number: CC0603JRNPO8BN150; Package: SMD 0603; Units: pF; Dielectric: NP0; Voltage: 25V; ComponentLink1Description: Datasheet; gost BOM: 0603 15pF ±5% 25V NP0
C16 C20 = EEEFK1H101P: EEEFK1H101P, 50V 100,0uF ±20%; Manufacturer: Panasonic; Value: 100,0; Units: uF; ESR: 0,34; Tmin: -55; Tmax: 105; Work: 2000; Component Note: CAPAE-F 100,0uF ±20% 50V; Part Number: EEEFK1H101P; Package: CAPAE-F; Tolerance: ±20%; Voltage: 50V; ComponentLink1Description: Datasheet; ComponentLink1URL: https://sds.compel.ru/item-pdf/31583381d324fa929794119b147f5f44/ps/pan~fk_smd.pdf; gost BOM: CAPAE-F 100,0uF ±20% 50V
C17 C21 = EEEFK1E220R: EEEFK1E220R, 25V 22,0uF ±20%; Manufacturer: Panasonic; Value: 22,0; Units: uF; ESR: 0,7; Tmin: -55; Tmax: 105; Work: 2000; Component Note: CAPAE-C 22,0uF ±20% 25V; Part Number: EEEFK1E220R; Package: CAPAE-C; Tolerance: ±20%; Voltage: 25V; ComponentLink1Description: Datasheet; ComponentLink1URL: https://sds.compel.ru/item-pdf/31583381d324fa929794119b147f5f44/ps/pan~fk_smd.pdf; gost BOM: CAPAE-C 22,0uF ±20% 25V
C19 C28-C30 C35 C37-C39 C41 C45 C48 C50-C53 = CL10B104KB8NNNC: CL10B104KB8NNNC, 0603 X7R 0,1 uF 50V; Manufacturer: Samsung; Value: 0,1; Tolerance: ±10%; Tmin: -55; Tmax: 125; Component Note: 0603 0,1uF ±10% 50V X7R; Part Number: CL10B104KB8NNNC; Package: SMD 0603; Units: uF; Dielectric: X7R; Voltage: 50V; ComponentLink1Description: Datasheet; ComponentLink1URL: https://media.digikey.com/pdf/Data%20Sheets/Samsung%20PDFs/CL_Series_MLCC_ds.pdf; gost BOM: 0603 0,1uF ±10% 50V X7R
C31-C34 = EEEFK1K220P: EEEFK1K220P, 80V 22,0uF ±20%; Manufacturer: Panasonic; Value: 22,0; Units: uF; ESR: 1,3; Tmin: -55; Tmax: 105; Work: 2000; Component Note: CAPAE-F 22,0uF ±20% 80V; Part Number: EEEFK1K220P; Package: CAPAE-F; Tolerance: ±20%; Voltage: 80V; ComponentLink1Description: Datasheet; ComponentLink1URL: https://sds.compel.ru/item-pdf/31583381d324fa929794119b147f5f44/ps/pan~fk_smd.pdf; gost BOM: CAPAE-F 22,0uF ±20% 80V
C42 C47 = CL32B225KCJSNNE: CL32B225KCJSNNE, 1210 X7R  2,2 uF 100V; Manufacturer: Samsung; Value: 2,2; Tolerance: ±10%; Tmin: -55; Tmax: 125; Component Note: 1210 2,2uF ±10% 100V X7R; Part Number: CL32B225KCJSNNE; Package: SMD 1210; Units: uF; Dielectric: X7R; Voltage: 100V; ComponentLink1Description: Datasheet; ComponentLink1URL: http://datasheet.octopart.com/CL32B225KCJSNNE-Samsung-datasheet-12549342.pdf; gost BOM: 1210 2,2uF ±10% 100V X7R
DA1 DA3 = UWF1205S-3WR3: DC/DC 4,5-36V, 5V, 3W; Manufacturer: MORNSUN; Vimin: 4,5; Vimax: 36; VO: 5; Current: 300mA; K: 77; Tmin: -40; Tmax: 105; Cap: 220; Component Note: SIP7, 4,5/5; gost BOM: UWF1205S-3WR3 MORNSUN; Part Number: UWF1205S-3WR3; Package: SIP7; Type: DC/DC; Power: 3W; ComponentLink1Description: Datasheet
DA2 DA13 DA16 DA23 DA28 DA29 = IRS2011SPbf: Микросхема IRS2011SPBF, SOIC-8; Manufacturer: International Rectifier; Part Number: IRS2011SPbf; Package: SO-8; Type: FETDRIVER; ComponentLink1Description: Datasheet; Component Note: SO-8; gost BOM: =A2&" "&B95
DA4-DA6 DA8-DA11 DA14 DA18 DA20 DA24 DA27 DA30 DA31 = SN74LVC2G17DBVR: Dual Schmitt-Trigger Buffer; Manufacturer: Texas Instruments; Tmin: -40; Tmax: 125; Part Number: SN74LVC2G17DBVR; Package: SOT23-6; Type: Buffer; ComponentLink1Description: Datasheet; ComponentLink1URL: https://www.ti.com/lit/ds/sces381n/sces381n.pdf; Component Note: SOT23-6; gost BOM: =A2&" "&B278
DA7 = AM2S-2415SZ: DC/DC 21,6-26,4V, 15V, 2W; Manufacturer: Aimtec; Vimin: 21,6; Vimax: 26,4; VO: 15; Current: 130; K: 84; Tmin: -40; Tmax: 85; Component Note: , 21,6/15; gost BOM: AM2S-2415SZ Aimtec; Part Number: AM2S-2415SZ; Type: DC/DC; Power: 2W; ComponentLink1Description: Datasheet; ComponentLink1URL: http://www.aimtec.com/site/Aimtec/files/Datasheet/HighResolution/AM2S-Z.pdf
DA12 = AM2S-2403SZ: DC/DC 21,6-26,4V, 3,3V, 2W; Manufacturer: Aimtec; Vimin: 21,6; Vimax: 26,4; VO: 3,3; Current: 400; K: 74; Tmin: -40; Tmax: 85; Component Note: , 21,6/3,3; gost BOM: AM2S-2403SZ Aimtec; Part Number: AM2S-2403SZ; Type: DC/DC; Power: 2W; ComponentLink1Description: Datasheet; ComponentLink1URL: http://www.aimtec.com/site/Aimtec/files/Datasheet/HighResolution/AM2S-Z.pdf
DA17 DA22 DA26 = LM2904DR2G: Low power dual operational amplifier; Manufacturer: On Semiconductor; FREQ: 1MHz; Chanels: 2; Tmin: -40; Tmax: 105; gost BOM: LM2904DR2G On Semiconductor; Part Number: LM2904DR2G; Package: SO-8; Type: OPAMP; ComponentLink1Description: Datasheet; ComponentLink1URL: https://www.onsemi.com/pdf/datasheet/lm358-d.pdf; Component Note: SO-8
DD1-DD8 DD10-DD13 = 249ЛП5: Оптоэлектронный переключатель-инвертор; Manufacturer: ОАО"Протон"; TU: бКО. 347.412 ТУ; Part Number: 249ЛП5; Package: 401.14-3; ComponentLink1Description: Datasheet; ComponentLink1URL: https://www.proton-orel.ru/files/products/optopary/germetic/logicheskie/6-04-2017/249lp5.pdf; Component Note: 401.14-3
DD9 = STM32F205RGT6: STM32F205RGT6, ARM Cortex-M3,1024 KB Flash, 128 KB RAM, LQFP64; Manufacturer: STMicroelectronics; CPU Speed: 150 DMIPS; FREQ: 120; RAM: 128 KB; FLASH: 1024 KB; CAN: 2; Tmin: -40; Tmax: 125; gost BOM: STM32F205RGT6 STMicroelectronics; Part Number: STM32F205RGT6; Package: LQFP64; Core: ARM Cortex-M3; EEPROM: -; ETH: -; ComponentLink1Description: Datasheet; ComponentLink1URL: http://www.st.com/st-web-ui/static/active/en/resource/technical/document/reference_manual/CD00171190.pdf; Component Note: LQFP64
L1 L2 = IHLP6767GZER150M01: 17.2x17.2x7 mm, 15,0uH 12,5; Manufacturer: Vishay; Value: 15,0uH; Current: 12,5; Part Number: IHLP6767GZER150M01; Package: 17.2x17.2x7 mm; ComponentLink1Description: Datasheet; Component Note: 17.2x17.2x7 mm, 15,0uH 12,5; gost BOM: 17.2x17.2x7 mm, 15,0uH 12,5
L3-L8 = IHLP6767GZER101: 17.2x17.2x7 mm, 100uH 5; Manufacturer: Vishay; Current: 5; DCR: 110; CurrentSatur: 4; Part Number: IHLP6767GZER101; Package: 17.2x17.2x7 mm; Value: 100uH; ComponentLink1Description: Datasheet; Component Note: 17.2x17.2x7 mm, 100uH 5; gost BOM: 17.2x17.2x7 mm, 100uH 5
R1-R4 R12-R15 R27-R30 = Р1-12-0,125-340 Ом ±1%: Р1-12-0,125-340 Ом ±1%, 0,125 SMD 0805; Power: 0,125; Component Note: 0805 340R 1%; TU: АЛЯР.434110.005 ТУ; Part Number: Р1-12-0,125-340 Ом ±1%; Package: SMD 0805; Type: Р1-12; Value: 340R; Tolerance: 1%
R5-R8 R18-R21 R32-R35 = Р1-12-0,125-169 Ом ±1%: Р1-12-0,125-169 Ом ±1%, 0,125 SMD 0805; Power: 0,125; Component Note: 0805 169R 1%; TU: АЛЯР.434110.005 ТУ; Part Number: Р1-12-0,125-169 Ом ±1%; Package: SMD 0805; Type: Р1-12; Value: 169R; Tolerance: 1%
R9-R11 R16 R17 R22-R26 R31 R36 R52 R55 R58 R64 R69 R70 R76 R78 = Р1-12-0,062-20 кОм ±5%: Р1-12-0,062-20 кОм ±5%, 0,062 SMD 0402; Power: 0,062; Component Note: 0402 20k 0,05; TU: АЛЯР.434110.005 ТУ; Part Number: Р1-12-0,062-20 кОм ±5%; Package: SMD 0402; Type: Р1-12; Value: 20k; Tolerance: 5%
R37 = Р1-12-0,062-680 Ом ±1%: Р1-12-0,062-680 Ом ±1%, 0,062 SMD 0402; Power: 0,062; Component Note: 0402 680R 1%; TU: АЛЯР.434110.005 ТУ; Part Number: Р1-12-0,062-680 Ом ±1%; Package: SMD 0402; Type: Р1-12; Value: 680R; Tolerance: 1%
R38 R42 R45 R48 R49 R56 R66 R73 R79 R91 R98 R103 = Р1-12-0,125-10 кОм ±5%: Р1-12-0,125-10 кОм ±5%, 0,125 SMD 0805; Power: 0,125; Component Note: 0805 10k 0,05; TU: АЛЯР.434110.005 ТУ; Part Number: Р1-12-0,125-10 кОм ±5%; Package: SMD 0805; Type: Р1-12; Value: 10k; Tolerance: 5%
R39 R43 R44 = Р1-12-0,062-10 кОм ±5%: Р1-12-0,062-10 кОм ±5%, 0,062 SMD 0402; Power: 0,062; Component Note: 0402 10k 0,05; TU: АЛЯР.434110.005 ТУ; Part Number: Р1-12-0,062-10 кОм ±5%; Package: SMD 0402; Type: Р1-12; Value: 10k; Tolerance: 5%
R40 R41 R46 R47 R51 R53 R68 R71 R81 R88 R100 R102 = Р1-12-0,125-15 Ом ±1%: Р1-12-0,125-15 Ом ±1%, 0,125 SMD 0805; Power: 0,125; Component Note: 0805 15R 1%; TU: АЛЯР.434110.005 ТУ; Part Number: Р1-12-0,125-15 Ом ±1%; Package: SMD 0805; Type: Р1-12; Value: 15R; Tolerance: 1%
R50 R57 R67 R75 = Р1-12-0,062-1.2 кОм ±1%: Р1-12-0,062-1.27 кОм ±1%, 0,062 SMD 0402; Power: 0,062; Component Note: 0402 1.2k 1%; TU: АЛЯР.434110.005 ТУ; Part Number: Р1-12-0,062-1.2 кОм ±1%; Package: SMD 0402; Type: Р1-12; Value: 1.2k; Tolerance: 1%
R54 R63 R72 R77 = Р1-12-0,062-47 кОм ±1%: Р1-12-0,062-47 кОм ±1%, 0,062 SMD 0402; Power: 0,062; Component Note: 0402 47k 1%; TU: АЛЯР.434110.005 ТУ; Part Number: Р1-12-0,062-47 кОм ±1%; Package: SMD 0402; Type: Р1-12; Value: 47k; Tolerance: 1%
R59-R62 R84-R87 = WSR3R2000FEA: WSR3R2000FEA, WSR-3 1% 0R20; Manufacturer: Vishay Dale; Component Note: SR-3 0R20 1%; Part Number: WSR3R2000FEA; Package: WSR-3; Value: 0R20; Tolerance: 1%; ComponentLink1Description: Datasheet; ComponentLink1URL: http://www.vishay.com/docs/30101/wsr.pdf
R65 R74 = Р1-12-0,062-620 кОм ±5%: Р1-12-0,062-620 кОм ±5%, 0,062 SMD 0402; Power: 0,062; Component Note: 0402 620k 0,05; TU: АЛЯР.434110.005 ТУ; Part Number: Р1-12-0,062-620 кОм ±5%; Package: SMD 0402; Type: Р1-12; Value: 620k; Tolerance: 5%
R80 R92 = Р1-12-0,062-18 кОм ±1%: Р1-12-0,062-18 кОм ±1%, 0,062 SMD 0402; Power: 0,062; Component Note: 0402 18k 1%; TU: АЛЯР.434110.005 ТУ; Part Number: Р1-12-0,062-18 кОм ±1%; Package: SMD 0402; Type: Р1-12; Value: 18k; Tolerance: 1%
R82 R94 = Р1-12-0,062-10 кОм ±1%: Р1-12-0,062-10 кОм ±1%, 0,062 SMD 0402; Power: 0,062; Component Note: 0402 10k 1%; TU: АЛЯР.434110.005 ТУ; Part Number: Р1-12-0,062-10 кОм ±1%; Package: SMD 0402; Type: Р1-12; Value: 10k; Tolerance: 1%
R83 R89 R90 R93 R95 R96 = Р1-12-0,125-95,3 Ом ±1%: Р1-12-0,125-95,3 Ом ±1%, 0,125 SMD 0805; Power: 0,125; Component Note: 0805 95,3R 1%; TU: АЛЯР.434110.005 ТУ; Part Number: Р1-12-0,125-95,3 Ом ±1%; Package: SMD 0805; Type: Р1-12; Value: 95,3R; Tolerance: 1%
R97 R99 R101 = Р1-12-0,062-1 кОм ±5%: Р1-12-0,062-1 кОм ±5%, 0,062 SMD 0402; Power: 0,062; Component Note: 0402 1k 0,05; TU: АЛЯР.434110.005 ТУ; Part Number: Р1-12-0,062-1 кОм ±5%; Package: SMD 0402; Type: Р1-12; Value: 1k; Tolerance: 5%
VD1 VD2 VD5-VD8 = DFLS160-7: DFLS160-7, SOD123 60V 1A, 0,5V; Manufacturer: Diodes Incorporated; Voltage: 60; Vf: 0,5; Current: 1; gost BOM: DFLS160-7 Diodes Incorporated; Part Number: DFLS160-7; Package: SOD123; ComponentLink1Description: Datasheet; Component Note: SOD123
VT1-VT12 = IRFR7740PbF: IRFR7740PbF, D-PAK 87A 75V; Manufacturer: Infineon; Type: N; I Drain: 87; U Gate th: 2,1; U Gate max: 20; U Drain-Source: 75; Input Cap: 4430; RDS: 0,0072; gost BOM: IRFR7740PbF Infineon; Component Note: D-PAK, N, 75V, 87A; Part Number: IRFR7740PbF; Package: D-PAK; ComponentLink1Description: Datasheet
ZQ1 = ABM3-8.000MHZ-D2Y-T: ABM3-8.000MHZ-D2Y-T, ABM3 8 МГц 18pF; Manufacturer: Abracon LLC; Part Number: ABM3-8.000MHZ-D2Y-T; Package: ABM3; Value: 8 МГц; Load Capacitance: 18pF; ComponentLink1Description: Datasheet; ComponentLink1URL: https://abracon.com/Resonators/abm3.pdf; Component Note: ABM3 8 МГц; gost BOM: ABM3 8 МГц
DA15 DA19 DA21 DA25 = IL300: ComponentLink1Description: Chipdip; ComponentLink1URL: https://www.chipdip.ru/product0/8003193245